# Altium schematic sheet Pre_Amp.SchDoc
size A; SheetNumber: 1; SheetTotal: 1
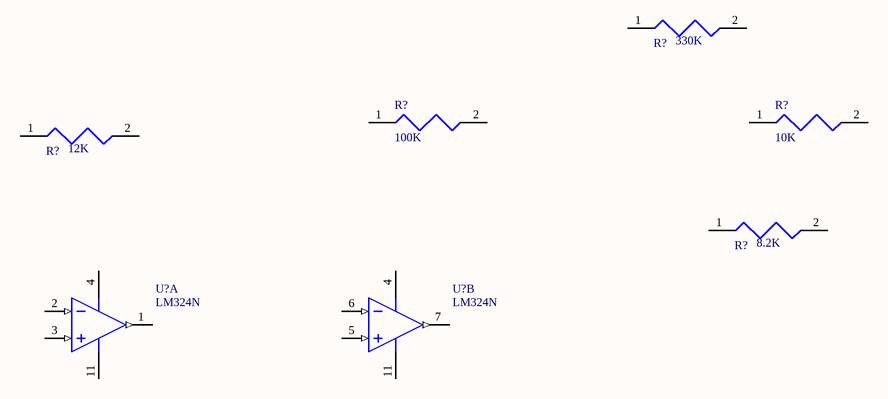
[diagram p0: Pre_Amp.SchDoc]

## Parts
(Parts that share a designator on the sheet are numbered #1, #2 ... from top to bottom, then left to right.)
R?#1  330K
R?#2  100K
R?#3  10K
R?#4  12K
R?#5  8.2K
U?#1  LM324N  [N0014A]  (part A of 4)
U?#2  LM324N  [N0014A]  (part B of 4)

## Nets

Not connected (* = marked no-connect by the designer): R?#1 1 2; R?#2 1 2; R?#3 1 2; R?#4 1 2; R?#5 1 2; U?#1 1(OUT1) 2(IN1-) 3(IN1+) 4(V+) 11(GND); U?#2 4(V+) 5(IN2+) 6(IN2-) 7(OUT2) 11(GND)

## Library data of the parts
R?#1 = RN65D3303FB14: Metal Film Resistors - Through Hole 1/2watt 330Kohms 1% 100ppm; Manufacturer: Vishay Dale; Resistance: 330kR; Power Rating: 500mW; Voltage Rating: 350V; Temperature Coefficient: 100ppm/°C; Lead Diameter: 0.64mm; Supplier 1: Mouser; Supplier Part Number 1: 71-RN65D-F-330K; Manufacturer Part Number: RN65D3303FB14; RoHS: No; Category: Through-Hole Resistors; Stock 1: 509; Pricing 1: 1=0.53, 10=0.429, 50=0.429, 100=0.429, 1000=0.429, 10000=0.272 (USD); Mount: Through Hole; Case/Package: Axial; Min Operating Temperature: -65°C; Max Operating Temperature: 175°C; Tolerance: 1%; Packaging: Bulk; Package Quantity: 100; Termination: Axial; Number of Terminations: 2; Max Power Dissipation: 500mW; Features: Moisture Resistant,Military,Flame Retardant Coating; Series: Military, MIL-R-10509/2, RN65; Length: 0.562inch; Width: 4.57mm; Lead Free: Contains Lead; RoHS Compliant: No; ComponentLink1URL: https://datasheet.ciiva.com/13963/cmfmil-13963855.pdf?src-supplier=Digikey; ComponentLink1Description: https://datasheet.ciiva.com/13963/cmfmil-13963855.pdf?src-supplier=Digikey
R?#2 = 1625892-8: Resistor, Metal Oxide, Res 100 Kilohms, Pwr-Rtg 3 W, Tol 5%, Axial | TE Connectivity ROX3SJ100K; Lead/Base Style: 4746ConnectorType; Number of Resistors: 1NUMBER; Voltage Rating: 350V; Supplier 1: Rs; Supplier Part Number 1: 1372756; Manufacturer: TE Connectivity; Manufacturer Part Number: 1625892-8; RoHS: Yes; Category: Through-Hole Resistors; Stock 1: 2000; Pricing 1: 50=0.232, 500=0.213, 1000=0.192, 2000=0.172, 4000=0.151 (GBP); Number of Pins: 2NUMBER; Voltage Rating (DC): 350V; Operating Supply Voltage: 350V; ELV: 5681ELVCompliant; Reach SVHC Compliant: 4186SVHC; ComponentLink1URL: https://datasheet.ciiva.com/6532/eng-ds-1773271-e-6532845.pdf?src-supplier=Digikey; ComponentLink1Description: https://datasheet.ciiva.com/6532/eng-ds-1773271-e-6532845.pdf?src-supplier=Digikey; ComponentLink2URL: https://datasheet.ciiva.com/45988/eng-ds-1773271-d-45988154.pdf?src-supplier=Onlinecomponents.com; ComponentLink2Description: https://datasheet.ciiva.com/45988/eng-ds-1773271-d-45988154.pdf?src-supplier=Onlinecomponents.com; ComponentLink3URL: https://datasheet.ciiva.com/17060/eng-ds-1773271-a-17060600.pdf?; ComponentLink3Description: https://datasheet.ciiva.com/17060/eng-ds-1773271-a-17060600.pdf?
R?#3 = CF14JT10K0: Res Carbon Film 10K Ohm 5% 0.25W(1/4W) -500ppm/ to 0ppm|||| Conformal Coated AXL T/R; Manufacturer: Stackpole Electronics; Supplier 1: Arrow Electronics; Supplier Part Number 1: CF14JT10K0; Manufacturer Part Number: CF14JT10K0; RoHS: Yes; Category: Through-Hole Resistors; Stock 1: 580000; Pricing 1: 5000=0.0073, 10000=0.0064 (USD); Lead Free: 5697LeadFree; ComponentLink1URL: http://components.arrow.com/part/dataview/27619991S9848636N1174?src-supplier=Arrow+Electronics; ComponentLink1Description: http://components.arrow.com/part/dataview/27619991S9848636N1174?src-supplier=Arrow+Electronics; ComponentLink2URL: https://www.seielect.com/catalog/SEI-Packaging.pdf?src-supplier=Digikey; ComponentLink2Description: https://www.seielect.com/catalog/SEI-Packaging.pdf?src-supplier=Digikey; ComponentLink3URL: https://www.verical.com/server-webapp/html/getDatasheet?partID=367360&src-supplier=Verical; ComponentLink3Description: https://www.verical.com/server-webapp/html/getDatasheet?partID=367360&src-supplier=Verical; ComponentLink4URL: https://www.seielect.com/catalog/SEI-CF_CFM.pdf?src-supplier=Avnet; ComponentLink4Description: https://www.seielect.com/catalog/SEI-CF_CFM.pdf?src-supplier=Avnet; ComponentLink5URL: http://www.seielect.com/Catalog/SEI-CF_CFM.pdf?src-supplier=Future+Electronics; ComponentLink5Description: http://www.seielect.com/Catalog/SEI-CF_CFM.pdf?src-supplier=Future+Electronics; ComponentLink6URL: https://datasheet.octopart.com/CF14JT10K0-Stackpole-Electronics-datasheet-8325406.pdf?src-supplier=Future+Electronics; ComponentLink6Description: https://datasheet.octopart.com/CF14JT10K0-Stackpole-Electronics-datasheet-8325406.pdf?src-supplier=Future+Electronics
R?#4 = RNMF14FTC12K0: Res Metal Film 12K Ohm 1% 1/4W ±50ppm/°C Conformal Axial Thru-Hole T/R; Manufacturer: Stackpole Electronics; Resistance: 12kR; Max Power Dissipation: 250mW; Supplier 1: Arrow Electronics; Supplier Part Number 1: RNMF14FTC12K0; Manufacturer Part Number: RNMF14FTC12K0; RoHS: Yes; Category: Through-Hole Resistors; Stock 1: 1810; Pricing 1: 1=0.041, 10=0.0205, 25=0.02, 100=0.0192, 250=0.0184, 500=0.0176, 1000=0.0168 (USD); Mount: Through Hole; Case/Package: Axial; Contact Plating: Tin,Matte; Min Operating Temperature: -55°C; Max Operating Temperature: 155°C; Tolerance: 1%; Package Quantity: 1; Packaging: Tape and Reel; Number of Terminations: 2; Temperature Coefficient: 50ppm/°C; Features: Flame Retardant Coating; Series: RNMF; Diameter: 2.35mm; Length: 0.13inch; Radiation Hardening: No; RoHS Compliant: Yes; ComponentLink1URL: http://www.seielect.com/Catalog/SEI-RNF_RNMF.pdf?src-supplier=Avnet; ComponentLink1Description: http://www.seielect.com/Catalog/SEI-RNF_RNMF.pdf?src-supplier=Avnet; ComponentLink2URL: https://www.seielect.com/catalog/SEI-Packaging.pdf?src-supplier=Digikey; ComponentLink2Description: https://www.seielect.com/catalog/SEI-Packaging.pdf?src-supplier=Digikey
R?#5 = PCF14JT8K20: Res Carbon Film 8.2K Ohm 5% 1/4W -400ppm/°C to 0ppm/°C Conformal AXL Thru-Hole T/R; Manufacturer: Stackpole Electronics; Supplier 1: Digikey; Supplier Part Number 1: 738-PCF14JT8K20CT-ND; Manufacturer Part Number: PCF14JT8K20; RoHS: Yes; Category: Through-Hole Resistors; Stock 1: 5384; Pricing 1: 1=0.12, 10=0.1, 25=0.0728, 50=0.0566, 100=0.0384, 250=0.03152, 500=0.02504, 1000=0.01778 (USD); ComponentLink1URL: http://www.seielect.com/Catalog/SEI-CF_CFM.pdf?src-supplier=Future+Electronics; ComponentLink1Description: http://www.seielect.com/Catalog/SEI-CF_CFM.pdf?src-supplier=Future+Electronics; ComponentLink2URL: https://www.seielect.com/catalog/sei-cf_cfm.pdf?src-supplier=Digikey; ComponentLink2Description: https://www.seielect.com/catalog/sei-cf_cfm.pdf?src-supplier=Digikey; ComponentLink3URL: https://www.seielect.com/catalog/SEI-CF_CFM.pdf?src-supplier=Avnet; ComponentLink3Description: https://www.seielect.com/catalog/SEI-CF_CFM.pdf?src-supplier=Avnet
U?#1 U?#2 = CMP-0055-00082-3: Low Power Quad Operational Amplifier, 14-pin MDIP; Manufacturer: Texas Instruments; CompType: Amplifiers; PowerWise: N; PackageTopMarking: NSUZXYYTTE#*LM324N; PackageDescription: MDIP, .750 x .250 x.130in, 14 Lead, .100in Pitch; Package Reference: N0014A; RoHS: N; Code_JEDEC: MS-001-AA; ComponentLink1URL: http://www.ti.com/general/docs/lit/getliterature.tsp?genericPartNumber=LM324&fileType=pdf; ComponentLink1Description: Datasheet URL; PinCount: 14